# Altium project Door Sensor PCB V2.PrjPcb
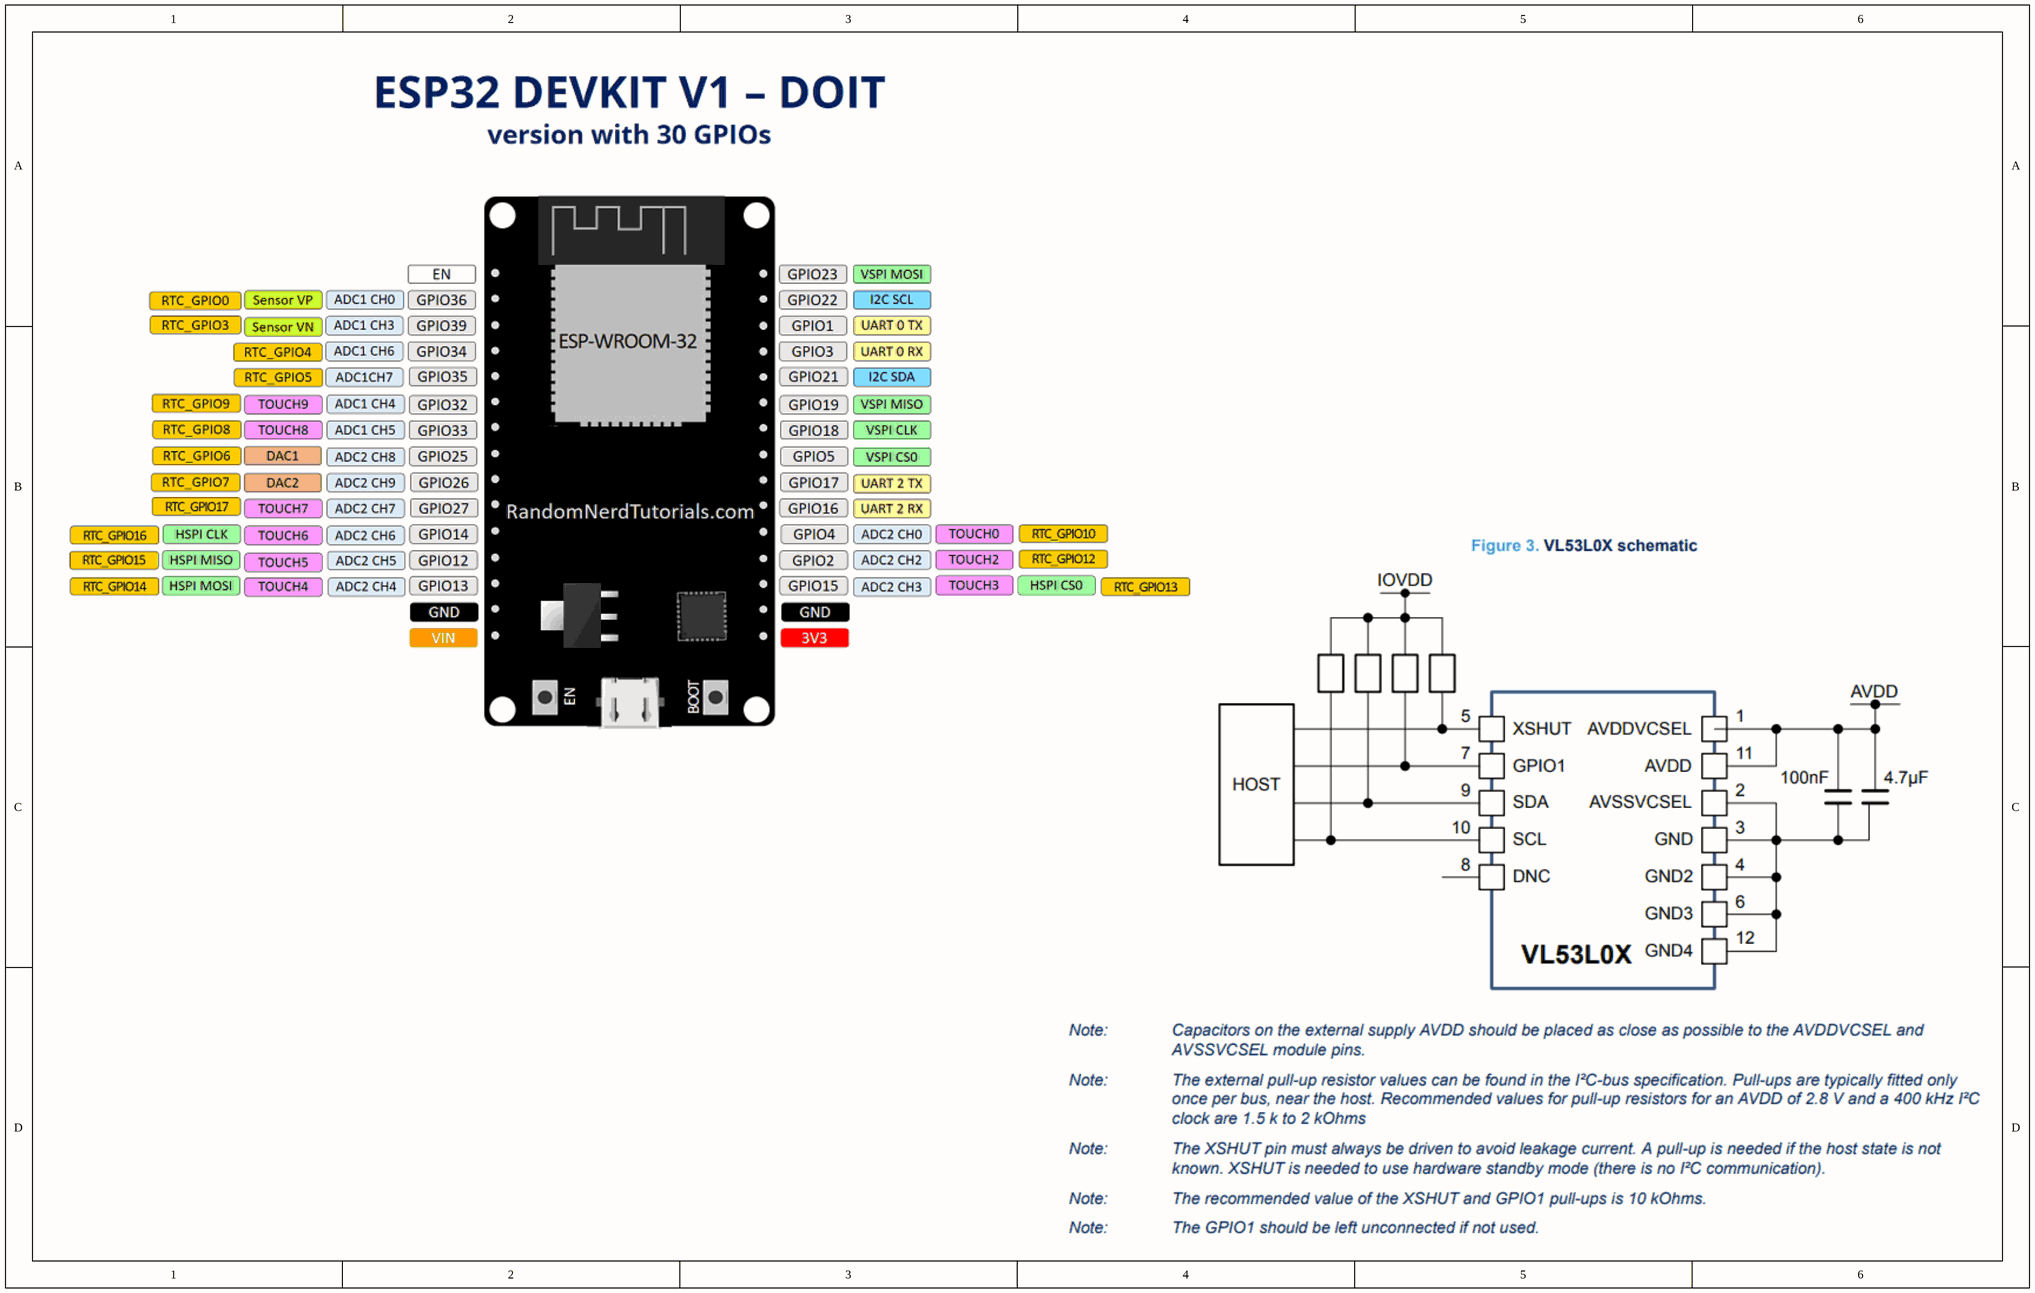
[diagram p0: Overview.SchDoc]
4 sheets, 49 parts. Net scope: global (net labels, ports and power ports of the same name join across sheets).
Board file: main.PcbDoc
Sheets:
  Overview.SchDoc
  Pico 2W and Sensor.SchDoc
  Power.SchDoc
  Connections.SchDoc

## Sheet Overview.SchDoc
size B; SheetNumber: 1; SheetTotal: 4

## Sheet Pico 2W and Sensor.SchDoc
size B; SheetNumber: 2; SheetTotal: 4
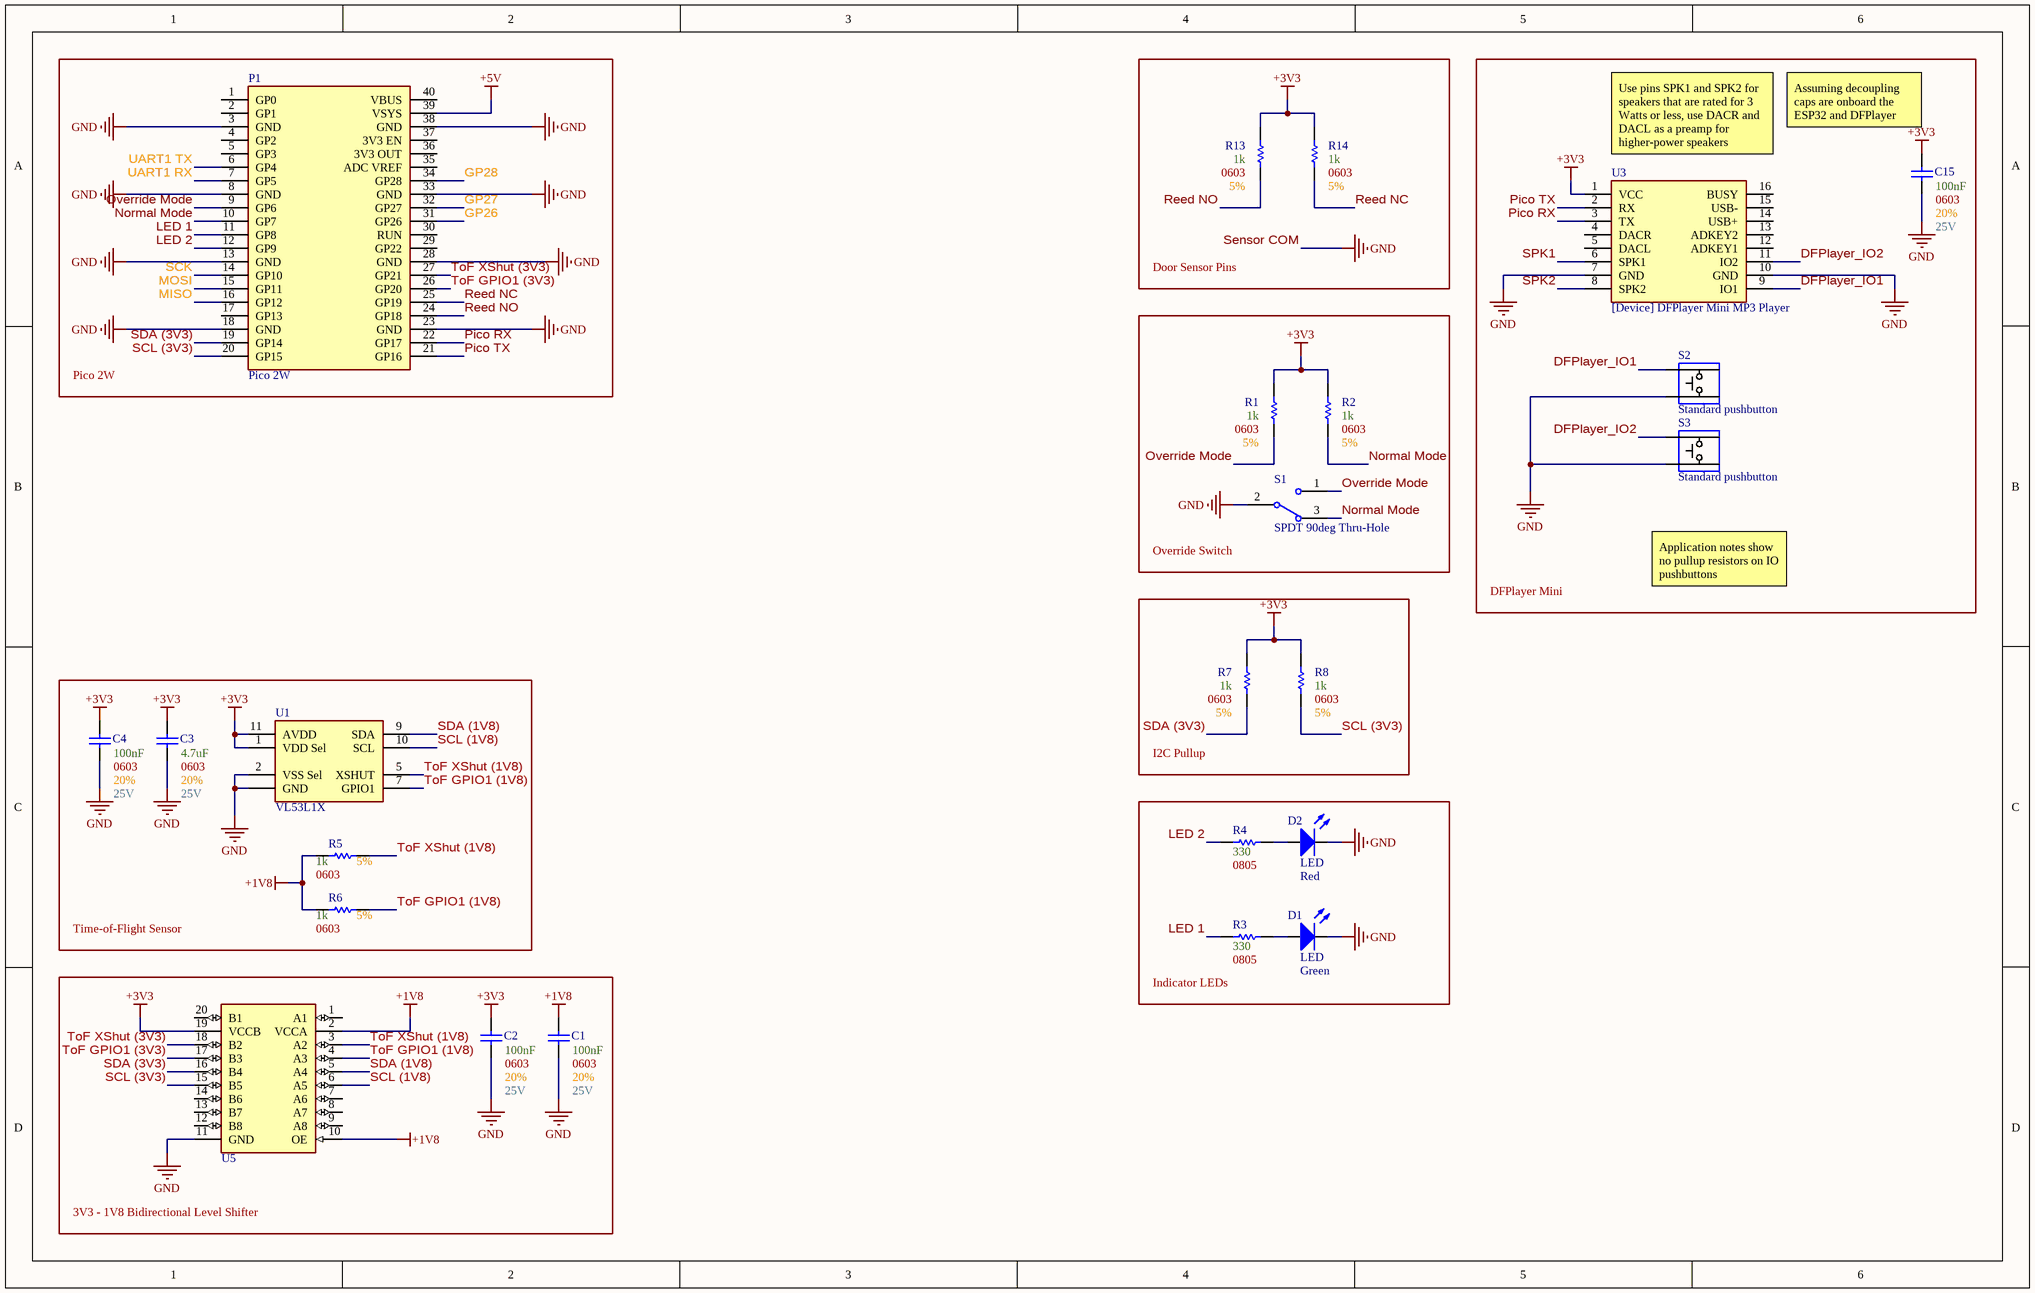
[diagram p1: Pico 2W and Sensor.SchDoc]

### Parts
(Parts that share a designator on the sheet are numbered #1, #2 ... from top to bottom, then left to right.)
C1  Voltage: 25V  Tolerance: 20%  Size Package: 0603  Capacitance: 100nF  [[Cap] SMD 0603]  (hidden comment: SMD Nonpolarized)
C2  Voltage: 25V  Tolerance: 20%  Size Package: 0603  Capacitance: 100nF  [[Cap] SMD 0603]  (hidden comment: SMD Nonpolarized)
C3  Voltage: 25V  Tolerance: 20%  Size Package: 0603  Capacitance: 4.7uF  [[Cap] SMD 0603]  (hidden comment: SMD Nonpolarized)
C4  Voltage: 25V  Tolerance: 20%  Size Package: 0603  Capacitance: 100nF  [[Cap] SMD 0603]  (hidden comment: SMD Nonpolarized)
C15#1  Voltage: 25V  Tolerance: 20%  Size Package: 0603  Capacitance: 100nF  [[Cap] SMD 0603]  (hidden comment: SMD Nonpolarized)
D1  LED  Color: Green  [[LED] Thru-Hole, 3mm, Green]
D2  LED  Color: Red  [[LED] Thru-Hole, 3mm, Red]
P1  Pico 2W  [[Device] RP Pico 2W]
R1  Tolerance: 5%  Resistance: 1k  Size Package: 0603  [[Res] SMD 0603]  (hidden comment: [Res] SMD Resistor)
R2  Tolerance: 5%  Resistance: 1k  Size Package: 0603  [[Res] SMD 0603]  (hidden comment: [Res] SMD Resistor)
R3  Resistance: 330  Size Package: 0805  [[Res] SMD 0805]  (hidden comment: [Res] SMD Resistor)
R4  Resistance: 330  Size Package: 0805  [[Res] SMD 0805]  (hidden comment: [Res] SMD Resistor)
R5  Tolerance: 5%  Resistance: 1k  Size Package: 0603  [[Res] SMD 0603]  (hidden comment: [Res] SMD Resistor)
R6  Tolerance: 5%  Resistance: 1k  Size Package: 0603  [[Res] SMD 0603]  (hidden comment: [Res] SMD Resistor)
R7  Tolerance: 5%  Resistance: 1k  Size Package: 0603  [[Res] SMD 0603]  (hidden comment: [Res] SMD Resistor)
R8  Tolerance: 5%  Resistance: 1k  Size Package: 0603  [[Res] SMD 0603]  (hidden comment: [Res] SMD Resistor)
R13  Tolerance: 5%  Resistance: 1k  Size Package: 0603  [[Res] SMD 0603]  (hidden comment: [Res] SMD Resistor)
R14  Tolerance: 5%  Resistance: 1k  Size Package: 0603  [[Res] SMD 0603]  (hidden comment: [Res] SMD Resistor)
S1  SPDT 90deg Thru-Hole  [[Switch] SPDT Toggle Switch 90deg]
S2  Standard pushbutton  [[Switch] Pushbutton]
S3  Standard pushbutton  [[Switch] Pushbutton]
U1  VL53L1X  [[Device] Time-of-Flight Sensor]
U3  [Device] DFPlayer Mini MP3 Player  [[Device] DFPlayer Mini MP3 Player]
U5  [IC] Level Shifter (2)  [[IC] Level Shifter (2)]  (value not drawn)

### Blocks framed on the sheet
Pico 2W: P1
Door Sensor Pins: R13 R14
DFPlayer Mini: C15#1 S2 S3 U3
Override Switch: R1 R2 S1
I2C Pullup: R7 R8
Time-of-Flight Sensor: C3 C4 R5 R6 U1
Indicator LEDs: D1 D2 R3 R4
3V3 - 1V8 Bidirectional Level Shifter: C1 C2 U5

### Nets
+1V8: C1.2 R5.2 R6.2 U5.2(VCCA) U5.10(OE)
+3V3: C2.2 C3.2 C4.2 C15#1.2 R1.1 R2.1 R7.1 R8.1 R13.1 R14.1 U1.1(VDD_Sel) U1.11(AVDD) U3.1(VCC) U5.19(VCCB)
+5V: P1.39(VSYS)
GND: C1.1 C2.1 C3.1 C4.1 C15#1.1 D1.2(K) D2.2(K) P1.3(GND) P1.8(GND) P1.13(GND) P1.18(GND) P1.23(GND) P1.28(GND) P1.33(GND) P1.38(GND) S1.2 S2.2 S3.2 U1.2(VSS_Sel) U1.GND U3.7(GND) U3.10(GND) U5.11(GND)  [also labelled Sensor COM]
DFPlayer_IO1: S2.1 U3.9(IO1)
DFPlayer_IO2: S3.1 U3.11(IO2)
GP26: P1.31(GP26)
GP27: P1.32(GP27)
GP28: P1.34(GP28)
LED 1: P1.11(GP8) R3.1
LED 2: P1.12(GP9) R4.1
MISO: P1.16(GP12)
MOSI: P1.15(GP11)
Normal Mode: P1.10(GP7) R2.2 S1.3
Override Mode: P1.9(GP6) R1.2 S1.1
Pico RX: P1.22(GP17) U3.3(TX)
Pico TX: P1.21(GP16) U3.2(RX)
Reed NC: P1.25(GP19) R14.2
Reed NO: P1.24(GP18) R13.2
SCK: P1.14(GP10)
SCL (1V8): U1.10(SCL) U5.6(A5)
SCL (3V3): P1.20(GP15) R8.2 U5.15(B5)
SDA (1V8): U1.9(SDA) U5.5(A4)
SDA (3V3): P1.19(GP14) R7.2 U5.16(B4)
SPK1: U3.6(SPK1)
SPK2: U3.8(SPK2)
ToF GPIO1 (1V8): R6.1 U1.7(GPIO1) U5.4(A3)
ToF GPIO1 (3V3): P1.26(GP20) U5.17(B3)
ToF XShut (1V8): R5.1 U1.5(XSHUT) U5.3(A2)
ToF XShut (3V3): P1.27(GP21) U5.18(B2)
UART1 RX: P1.7(GP5)
UART1 TX: P1.6(GP4)
NetD1_1: D1.1(A) R3.2
NetD2_1: D2.1(A) R4.2

Not connected (* = marked no-connect by the designer): P1 1(GP0) 2(GP1) 4(GP2) 5(GP3) 17(GP13) 29(GP22) 30(RUN) 35(ADC_VREF) 36(3V3_OUT) 37(3V3_EN) 40(VBUS); U3 4(DACR) 5(DACL) 12(ADKEY1) 13(ADKEY2) 14(USB+) 15(USB-) 16(BUSY); U5 1(A1) 7(A6) 8(A7) 9(A8) 12(B8) 13(B7) 14(B6) 20(B1)

### Notes on the sheet
- (near U3) Use pins SPK1 and SPK2 for speakers that are rated for 3 Watts or less, use DACR and DACL as a preamp for higher-power speakers
- (near C15#1) Assuming decoupling caps are onboard the ESP32 and DFPlayer
- Application notes show no pullup resistors on IO pushbuttons

### Library data of the parts
C1-C4 C15#1 = [Cap] SMD Nonpolarized: Supplier 1: DigiKey; Supplier Part Number 1: 1276-1869-1-ND
D1 D2 = [LED] Thru-Hole 3mm: 3mm LED
P1 = [Device] RP Pico 2W
R1-R8 R13 R14 = [Res] SMD Resistor: Generic
S1 = [Switch] SPDT Toggle Switch 90deg: 100SP1T2B4M6QE
S2 S3 = [Switch] Pushbutton: Supplier 1: DigiKey; Supplier Part Number 1: 450-1650-ND
U1 = [Device] Time-of-Flight Sensor: VL53L0CXV0DH/1
U5 = [IC] Level Shifter (2): TXS0108EQPWRQ1; Supplier 1: DigiKey; Supplier Part Number 1: 296-42401-1-ND
U3 = [Device] DFPlayer Mini MP3 Player: ComponentLink1Description: Datasheet; ComponentLink1URL: https://picaxe.com/docs/spe033.pdf

## Sheet Power.SchDoc
size A; SheetNumber: 3; SheetTotal: 4
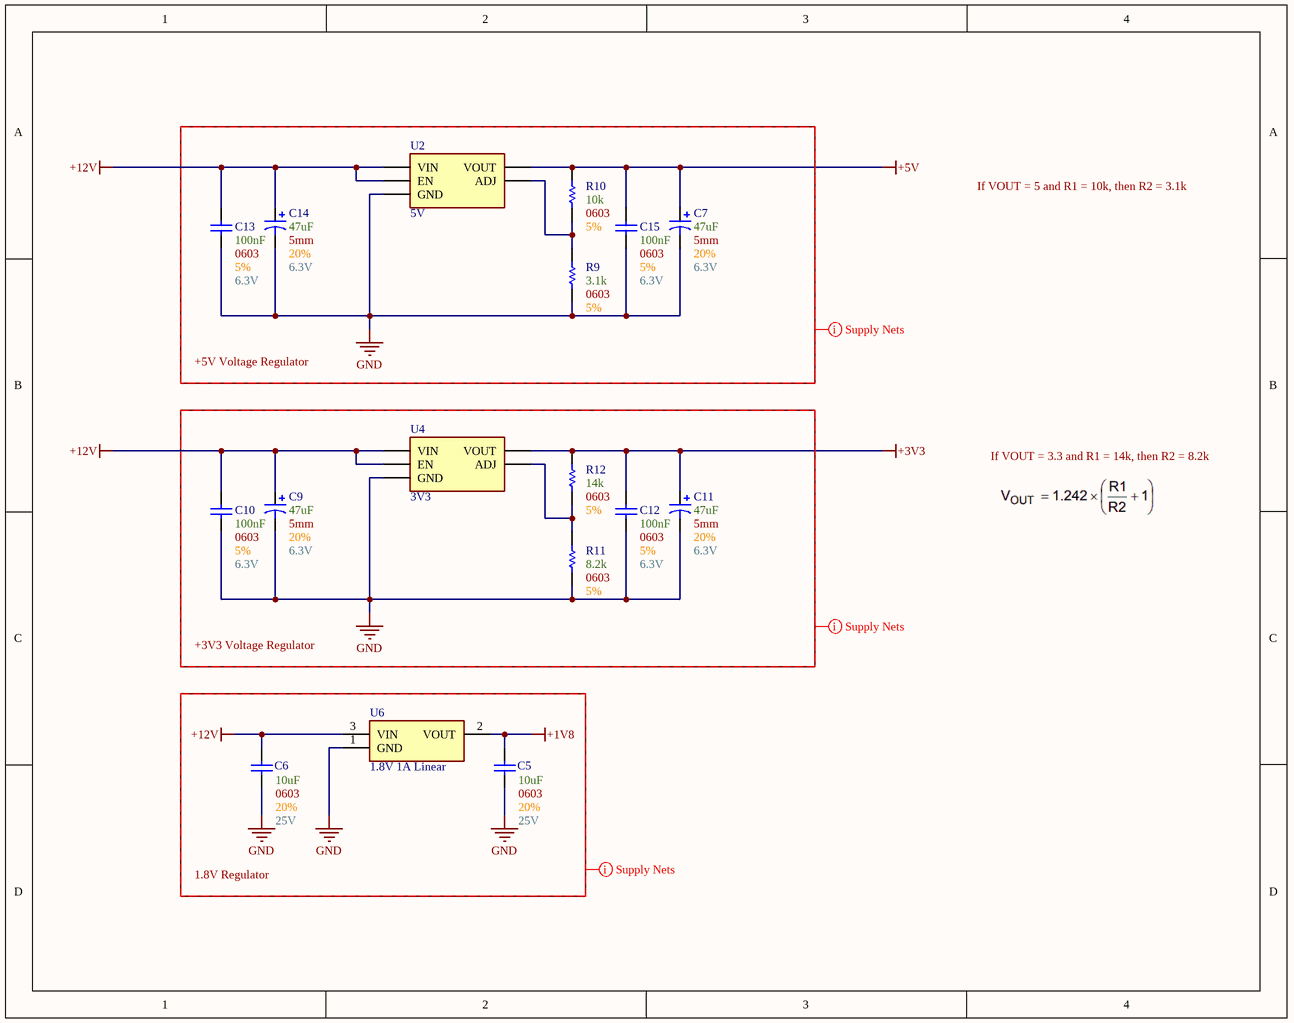
[diagram p2: Power.SchDoc]

### Parts
(Parts that share a designator on the sheet are numbered #1, #2 ... from top to bottom, then left to right.)
C5  Voltage: 25V  Tolerance: 20%  Size Package: 0603  Capacitance: 10uF  [[Cap] SMD 0603]  (hidden comment: SMD Nonpolarized)
C6  Voltage: 25V  Tolerance: 20%  Size Package: 0603  Capacitance: 10uF  [[Cap] SMD 0603]  (hidden comment: SMD Nonpolarized)
C7  Capacitance: 47uF  Diameter: 5mm  Tolerance: 20%  Max Voltage: 6.3V  [[Cap] SMD Polarized, 5mm]  (hidden comment: SMD Polarized)
C9  Capacitance: 47uF  Diameter: 5mm  Tolerance: 20%  Max Voltage: 6.3V  [[Cap] SMD Polarized, 5mm]  (hidden comment: SMD Polarized)
C10  Size Package: 0603  Capacitance: 100nF  Voltage: 6.3V  Tolerance: 5%  [[Cap] SMD 0603]  (hidden comment: [Cap] SMD Nonpolarized)
C11  Capacitance: 47uF  Diameter: 5mm  Tolerance: 20%  Max Voltage: 6.3V  [[Cap] SMD Polarized, 5mm]  (hidden comment: SMD Polarized)
C12  Size Package: 0603  Capacitance: 100nF  Voltage: 6.3V  Tolerance: 5%  [[Cap] SMD 0603]  (hidden comment: [Cap] SMD Nonpolarized)
C13  Size Package: 0603  Capacitance: 100nF  Voltage: 6.3V  Tolerance: 5%  [[Cap] SMD 0603]  (hidden comment: [Cap] SMD Nonpolarized)
C14  Capacitance: 47uF  Diameter: 5mm  Tolerance: 20%  Max Voltage: 6.3V  [[Cap] SMD Polarized, 5mm]  (hidden comment: SMD Polarized)
C15#2  Size Package: 0603  Capacitance: 100nF  Voltage: 6.3V  Tolerance: 5%  [[Cap] SMD 0603]  (hidden comment: [Cap] SMD Nonpolarized)
R9  Tolerance: 5%  Resistance: 3.1k  Size Package: 0603  [[Res] SMD 0603]  (hidden comment: [Res] SMD Resistor)
R10  Tolerance: 5%  Resistance: 10k  Size Package: 0603  [[Res] SMD 0603]  (hidden comment: [Res] SMD Resistor)
R11  Tolerance: 5%  Resistance: 8.2k  Size Package: 0603  [[Res] SMD 0603]  (hidden comment: [Res] SMD Resistor)
R12  Tolerance: 5%  Resistance: 14k  Size Package: 0603  [[Res] SMD 0603]  (hidden comment: [Res] SMD Resistor)
U2  5V  [[Reg] Variable Voltage Regulator]
U4  3V3  [[Reg] Variable Voltage Regulator]
U6  1.8V 1A Linear  [[Reg] 1.8V Regulator]

### Blocks framed on the sheet
+5V Voltage Regulator: C7 C13 C14 C15#2 R9 R10 U2
+3V3 Voltage Regulator: C9-C12 R11 R12 U4
1.8V Regulator: C5 C6 U6

### Nets
+1V8: C5.2 U6.2(VOUT)
+3V3: C11.1 C12.2 R12.2 U4.4(VOUT)
+5V: C7.1 C15#2.2 R10.2 U2.4(VOUT)
+12V: C6.2 C9.1 C10.2 C13.2 C14.1 U2.1(EN) U2.2(VIN) U4.1(EN) U4.2(VIN) U6.3(VIN)
GND: C5.1 C6.1 C7.2 C9.2 C10.1 C11.2 C12.1 C13.1 C14.2 C15#2.1 R9.1 R11.1 U2.3(GND) U4.3(GND) U6.1(GND)
NetR9_2: R9.2 R10.1 U2.5(ADJ)
NetR11_2: R11.2 R12.1 U4.5(ADJ)

### Layout directives
net class Supply_Nets: +1V8, +12V, GND

### Notes on the sheet
- If VOUT = 5 and R1 = 10k, then R2 = 3.1k
- If VOUT = 3.3 and R1 = 14k, then R2 = 8.2k

### Library data of the parts
C5 C6 = [Cap] SMD Nonpolarized: Supplier 1: DigiKey; Supplier Part Number 1: 1276-1869-1-ND
C7 C9 C11 C14 = [Cap] SMD Polarized: Supplier 1: DigiKey; Supplier Part Number 1: 493-2152-1-ND
R9-R12 = [Res] SMD Resistor: Generic; Supplier 1: DigiKey
  R9: Supplier Part Number 1: 311-3.16KHRCT-ND
  R10: Supplier Part Number 1: 311-10.0KHRDKR-ND
  R11: Supplier Part Number 1: 311-8.2KGRCT-ND
  R12: Supplier Part Number 1: RMCF0603FT14K0DKR-ND
U2 U4 = [Reg] Variable Voltage Regulator: MIC29302WT; Supplier 1: DigiKey; Supplier Part Number 1: 576-1124-ND
U6 = [Reg] 1.8V Regulator: NCP1117IST18T3G; Supplier 1: DigiKey; Supplier Part Number 1: 488-NCP1117IST18T3GCT-ND
C10 C12 C13 C15#2 = [Cap] SMD Nonpolarized: Supplier 1: DigiKey; Supplier Part Number 1: 311-1088-6-ND

## Sheet Connections.SchDoc
size A; SheetNumber: 4; SheetTotal: 4
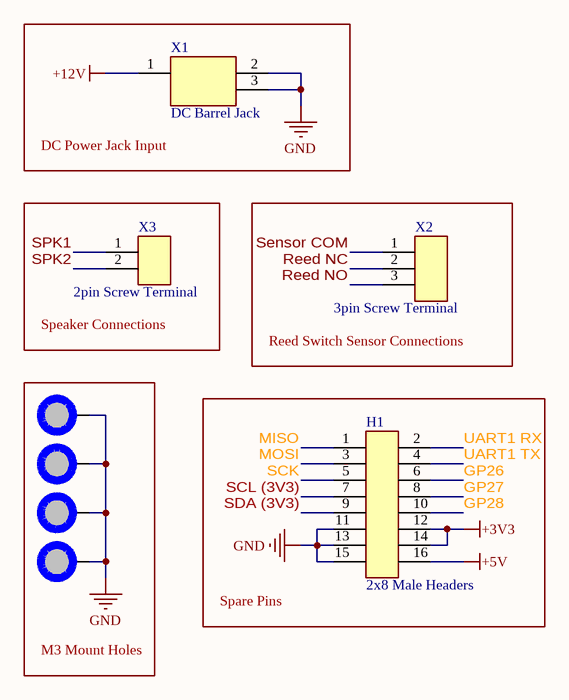
[diagram p3: Connections.SchDoc]

### Parts
H1  2x8 Male Headers  [[Header] 2x8 Male Headers]
Mount1  M3 Mount Hole  [[Mount] M3 Mount Hole]  (value not drawn)  (no BOM)
Mount2  M3 Mount Hole  [[Mount] M3 Mount Hole]  (value not drawn)  (no BOM)
Mount3  M3 Mount Hole  [[Mount] M3 Mount Hole]  (value not drawn)  (no BOM)
Mount4  M3 Mount Hole  [[Mount] M3 Mount Hole]  (value not drawn)  (no BOM)
X1  DC Barrel Jack  [[Port] DC Barrel Jack]
X2  3pin Screw Terminal  [[Screw Terminal] 3pin 5mm]
X3  2pin Screw Terminal  [[Screw Terminal] 2pin 5mm]

### Blocks framed on the sheet
DC Power Jack Input: X1
Speaker Connections: X3
Reed Switch Sensor Connections: X2
M3 Mount Holes: Mount1-Mount4
Spare Pins: H1

### Nets
+3V3: H1.12 H1.14
+5V: H1.16
+12V: X1.1(Pin)
GND: H1.11 H1.13 H1.15 Mount1.1 Mount2.1 Mount3.1 Mount4.1 X1.2(Barrel) X1.3(Barrel) X2.1  [also labelled Sensor COM]
GP26: H1.6
GP27: H1.8
GP28: H1.10
MISO: H1.1
MOSI: H1.3
Reed NC: X2.2
Reed NO: X2.3
SCK: H1.5
SCL (3V3): H1.7
SDA (3V3): H1.9
SPK1: X3.1
SPK2: X3.2
UART1 RX: H1.2
UART1 TX: H1.4

### Library data of the parts
H1 = [Header] 2x8 Male: 2.54mm pitch
Mount1-Mount4 = [Mount] M3 Mount Hole: Place at least 4.5mm from board edge. Plated.
X1 = [Port] DC Barrel Jack: Pin 1: Pin / Pin2/3: Barrel; Supplier 1: DigiKey; Supplier Part Number 1: CP-102A-ND
X2 = [Screw Terminal] 3pin: Supplier 1: DigiKey; Supplier Part Number 1: 102-6162-ND
X3 = [Screw Terminal] 2pin: Supplier 1: DigiKey; Supplier Part Number 1: 102-6145-ND

## Nets that join several sheets
+1V8: Pico 2W and Sensor (5 pins), Power (C5.2 U6.2)
+3V3: Pico 2W and Sensor (14 pins), Power (C11.1 C12.2 R12.2 U4.4), Connections (H1.12 H1.14)
+5V: Pico 2W and Sensor (P1.39), Power (C7.1 C15#2.2 R10.2 U2.4), Connections (H1.16)
+12V: Power (10 pins), Connections (X1.1)
GND: Pico 2W and Sensor (23 pins), Power (15 pins), Connections (10 pins)
GP26: Pico 2W and Sensor (P1.31), Connections (H1.6)
GP27: Pico 2W and Sensor (P1.32), Connections (H1.8)
GP28: Pico 2W and Sensor (P1.34), Connections (H1.10)
MISO: Pico 2W and Sensor (P1.16), Connections (H1.1)
MOSI: Pico 2W and Sensor (P1.15), Connections (H1.3)
Reed NC: Pico 2W and Sensor (P1.25 R14.2), Connections (X2.2)
Reed NO: Pico 2W and Sensor (P1.24 R13.2), Connections (X2.3)
SCK: Pico 2W and Sensor (P1.14), Connections (H1.5)
SCL (3V3): Pico 2W and Sensor (P1.20 R8.2 U5.15), Connections (H1.7)
SDA (3V3): Pico 2W and Sensor (P1.19 R7.2 U5.16), Connections (H1.9)
SPK1: Pico 2W and Sensor (U3.6), Connections (X3.1)
SPK2: Pico 2W and Sensor (U3.8), Connections (X3.2)
UART1 RX: Pico 2W and Sensor (P1.7), Connections (H1.2)
UART1 TX: Pico 2W and Sensor (P1.6), Connections (H1.4)